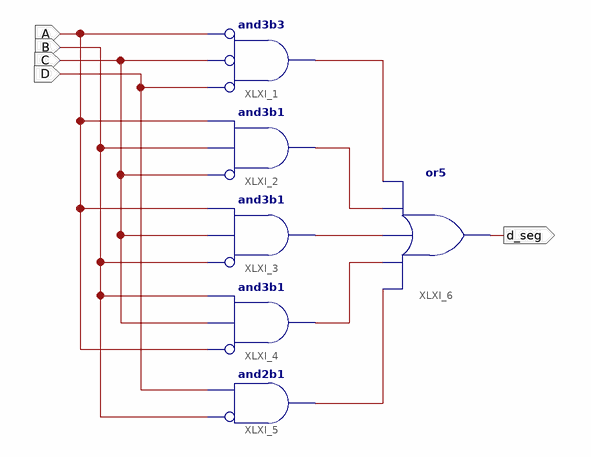
[diagram p0: schematic sheet 1]
// Xilinx ISE schematic bcd4to7d.sch (spartan6) as structural Verilog: 6 symbols, 5 ports
module bcd4to7d (
  input  A,
  input  B,
  input  C,
  input  D,
  output d_seg
);

  wire XLXN_1, XLXN_2, XLXN_3, XLXN_4, XLXN_5;

  and XLXI_1 (XLXN_1, ~D, ~C, ~A);  // and3b3
  and XLXI_2 (XLXN_2, ~C, B, A);  // and3b1
  and XLXI_3 (XLXN_3, ~B, C, A);  // and3b1
  and XLXI_4 (XLXN_4, ~A, C, B);  // and3b1
  and XLXI_5 (XLXN_5, ~B, D);  // and2b1
  or XLXI_6 (d_seg, XLXN_5, XLXN_4, XLXN_3, XLXN_2, XLXN_1);
endmodule
